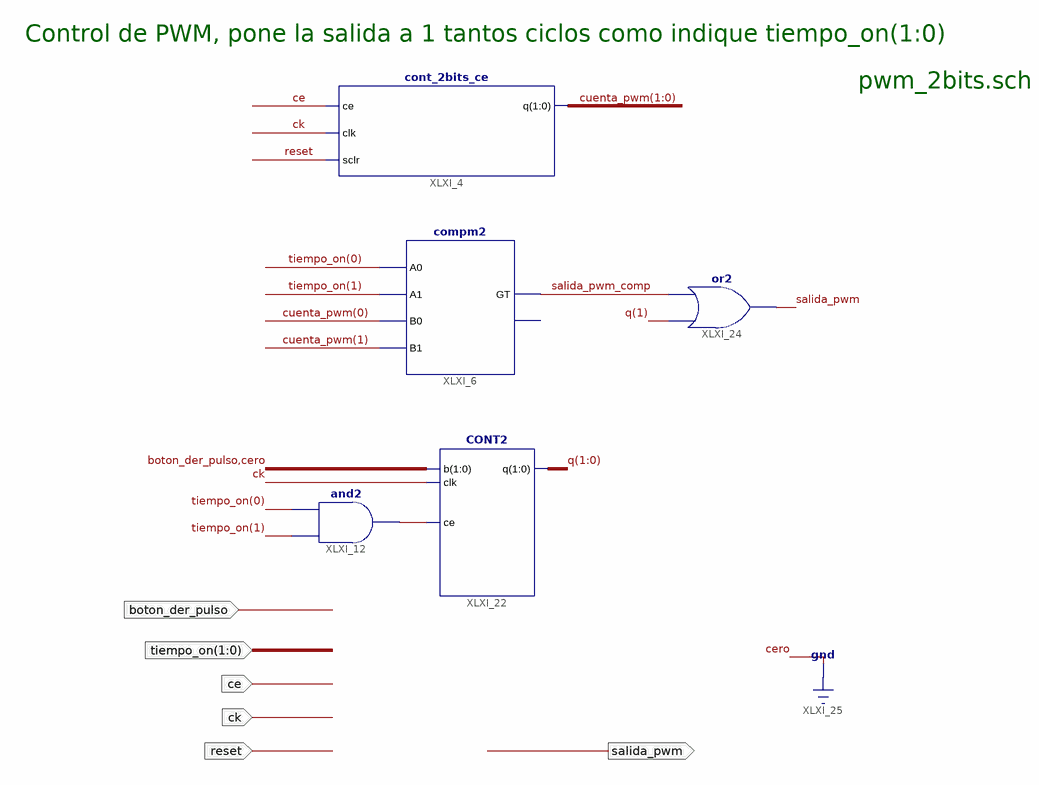
[diagram p0: schematic sheet 1]
// Xilinx ISE schematic pwm_2bits.sch (spartan6) as structural Verilog: 5 symbols, 6 ports
module pwm_2bits (
  input  ce,
  input  ck,
  input  reset,
  input  [1:0] tiempo_on,
  input  boton_der_pulso,
  output salida_pwm
);

  wire salida_pwm_comp, XLXN_12;
  wire [1:0] cuenta_pwm, q;

  cont_2bits_ce XLXI_4 (.q(cuenta_pwm), .ce(ce), .clk(ck), .sclr(reset));
  compm2 XLXI_6 (
    .A0(tiempo_on[0]), .A1(tiempo_on[1]), .B0(cuenta_pwm[0]), .B1(cuenta_pwm[1]), .GT(salida_pwm_comp));  // open: LT
  and XLXI_12 (XLXN_12, tiempo_on[1], tiempo_on[0]);
  CONT2 XLXI_22 (.b({boton_der_pulso, 1'b0}), .clk(ck), .ce(XLXN_12), .q(q));
  or XLXI_24 (salida_pwm, q[1], salida_pwm_comp);

  // Notes on the sheet:
  //   Control de PWM, pone la salida a 1 tantos ciclos como indique tiempo_on(1:0)
  //   pwm_2bits.sch
endmodule
